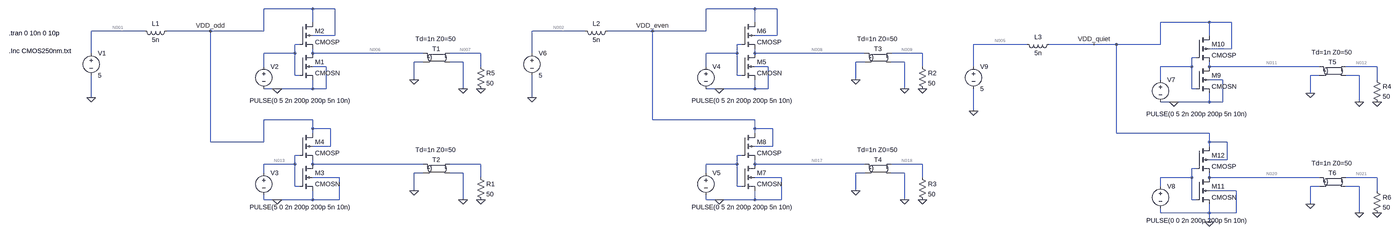
[diagram p0: schematic Draft3.asc, whole sheet]
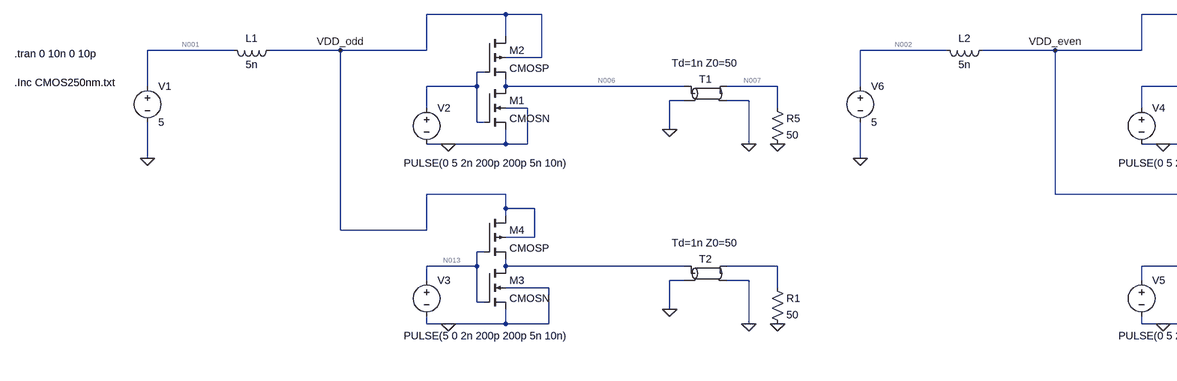
[diagram p1: schematic Draft3.asc, part, row 1 of 1, column 1 of 2]
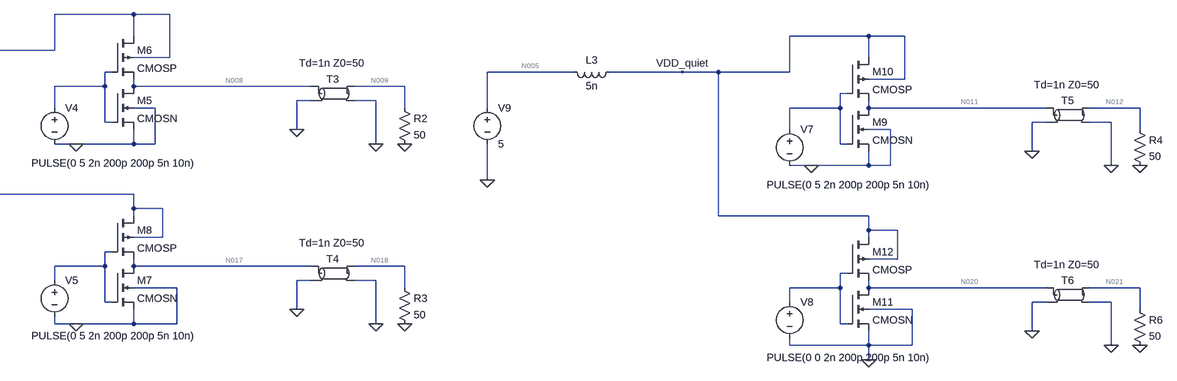
[diagram p2: schematic Draft3.asc, part, row 1 of 1, column 2 of 2]
Draft3.asc, the LTspice schematic file:
Version 4.1
SHEET 1 5000 2188
WIRE 592 416 416 416
WIRE 672 416 592 416
WIRE 2400 416 2224 416
WIRE 2480 416 2400 416
WIRE 592 464 592 416
WIRE 2400 464 2400 416
WIRE 4288 464 4112 464
WIRE 4368 464 4288 464
WIRE -176 496 -368 496
WIRE 224 496 -96 496
WIRE 416 496 416 416
WIRE 416 496 224 496
WIRE 1632 496 1440 496
WIRE 2032 496 1712 496
WIRE 2224 496 2224 416
WIRE 2224 496 2032 496
WIRE 672 512 672 416
WIRE 672 512 592 512
WIRE 2480 512 2480 416
WIRE 2480 512 2400 512
WIRE 4288 512 4288 464
WIRE 544 544 528 544
WIRE 2352 544 2336 544
WIRE 3520 544 3328 544
WIRE 3840 544 3600 544
WIRE 3920 544 3840 544
WIRE 4112 544 4112 464
WIRE 4112 544 3920 544
WIRE 4368 560 4368 464
WIRE 4368 560 4288 560
WIRE -368 576 -368 496
WIRE 528 576 528 544
WIRE 528 576 416 576
WIRE 592 576 592 560
WIRE 1040 576 592 576
WIRE 1248 576 1136 576
WIRE 1440 576 1440 496
WIRE 2336 576 2336 544
WIRE 2336 576 2224 576
WIRE 2400 576 2400 560
WIRE 2848 576 2400 576
WIRE 3056 576 2944 576
WIRE 4240 592 4224 592
WIRE 1040 608 1008 608
WIRE 1184 608 1136 608
WIRE 2848 608 2816 608
WIRE 2992 608 2944 608
WIRE 416 624 416 576
WIRE 640 624 592 624
WIRE 1248 624 1248 576
WIRE 2224 624 2224 576
WIRE 2448 624 2400 624
WIRE 3056 624 3056 576
WIRE 3328 624 3328 544
WIRE 4224 624 4224 592
WIRE 4224 624 4112 624
WIRE 4288 624 4288 608
WIRE 4736 624 4288 624
WIRE 4944 624 4832 624
WIRE 528 656 528 576
WIRE 544 656 528 656
WIRE 2336 656 2336 576
WIRE 2352 656 2336 656
WIRE 4736 656 4704 656
WIRE 4880 656 4832 656
WIRE 1008 672 1008 608
WIRE 2816 672 2816 608
WIRE 4112 672 4112 624
WIRE 4336 672 4288 672
WIRE 4944 672 4944 624
WIRE 464 704 416 704
WIRE 592 704 592 672
WIRE 592 704 464 704
WIRE 640 704 640 624
WIRE 640 704 592 704
WIRE 1184 704 1184 608
WIRE 2272 704 2224 704
WIRE 2400 704 2400 672
WIRE 2400 704 2272 704
WIRE 2448 704 2448 624
WIRE 2448 704 2400 704
WIRE 2992 704 2992 608
WIRE 4224 704 4224 624
WIRE 4240 704 4224 704
WIRE 4704 720 4704 656
WIRE -368 736 -368 656
WIRE 1440 736 1440 656
WIRE 4160 752 4112 752
WIRE 4288 752 4288 720
WIRE 4288 752 4160 752
WIRE 4336 752 4336 672
WIRE 4336 752 4288 752
WIRE 4880 752 4880 656
WIRE 3328 784 3328 704
WIRE 592 816 416 816
WIRE 2032 816 2032 496
WIRE 2400 816 2032 816
WIRE 592 848 592 816
WIRE 656 848 592 848
WIRE 2400 848 2400 816
WIRE 2464 848 2400 848
WIRE 592 864 592 848
WIRE 2400 864 2400 848
WIRE 3920 864 3920 544
WIRE 4288 864 3920 864
WIRE 224 896 224 496
WIRE 416 896 416 816
WIRE 416 896 224 896
WIRE 4288 896 4288 864
WIRE 4352 896 4288 896
WIRE 656 912 656 848
WIRE 656 912 592 912
WIRE 2464 912 2464 848
WIRE 2464 912 2400 912
WIRE 4288 912 4288 896
WIRE 544 944 528 944
WIRE 2352 944 2336 944
WIRE 4352 960 4352 896
WIRE 4352 960 4288 960
WIRE 528 976 528 944
WIRE 528 976 416 976
WIRE 592 976 592 960
WIRE 1040 976 592 976
WIRE 1248 976 1136 976
WIRE 2336 976 2336 944
WIRE 2336 976 2224 976
WIRE 2400 976 2400 960
WIRE 2848 976 2400 976
WIRE 3056 976 2944 976
WIRE 4240 992 4224 992
WIRE 416 1008 416 976
WIRE 1040 1008 1008 1008
WIRE 1184 1008 1136 1008
WIRE 2224 1008 2224 976
WIRE 2848 1008 2816 1008
WIRE 2992 1008 2944 1008
WIRE 688 1024 592 1024
WIRE 1248 1024 1248 976
WIRE 2496 1024 2400 1024
WIRE 3056 1024 3056 976
WIRE 4224 1024 4224 992
WIRE 4224 1024 4112 1024
WIRE 4288 1024 4288 1008
WIRE 4736 1024 4288 1024
WIRE 4944 1024 4832 1024
WIRE 528 1056 528 976
WIRE 544 1056 528 1056
WIRE 2336 1056 2336 976
WIRE 2352 1056 2336 1056
WIRE 4112 1056 4112 1024
WIRE 4736 1056 4704 1056
WIRE 4880 1056 4832 1056
WIRE 1008 1072 1008 1008
WIRE 2816 1072 2816 1008
WIRE 4384 1072 4288 1072
WIRE 4944 1072 4944 1024
WIRE 416 1104 416 1088
WIRE 464 1104 416 1104
WIRE 592 1104 592 1072
WIRE 592 1104 464 1104
WIRE 688 1104 688 1024
WIRE 688 1104 592 1104
WIRE 1184 1104 1184 1008
WIRE 2224 1104 2224 1088
WIRE 2272 1104 2224 1104
WIRE 2400 1104 2400 1072
WIRE 2400 1104 2272 1104
WIRE 2496 1104 2496 1024
WIRE 2496 1104 2400 1104
WIRE 2992 1104 2992 1008
WIRE 4224 1104 4224 1024
WIRE 4240 1104 4224 1104
WIRE 4704 1120 4704 1056
WIRE 4112 1152 4112 1136
WIRE 4288 1152 4288 1120
WIRE 4288 1152 4112 1152
WIRE 4384 1152 4384 1072
WIRE 4384 1152 4288 1152
WIRE 4880 1152 4880 1056
WIRE 4288 1184 4288 1152
FLAG -368 736 0
FLAG 1008 672 0
FLAG 1184 704 0
FLAG 1248 704 0
FLAG 464 704 0
FLAG 1008 1072 0
FLAG 1184 1104 0
FLAG 1248 1104 0
FLAG 464 1104 0
FLAG 1440 736 0
FLAG 2816 672 0
FLAG 2992 704 0
FLAG 3056 704 0
FLAG 2272 704 0
FLAG 2816 1072 0
FLAG 2992 1104 0
FLAG 3056 1104 0
FLAG 2272 1104 0
FLAG 3328 784 0
FLAG 4704 720 0
FLAG 4880 752 0
FLAG 4944 752 0
FLAG 4160 752 0
FLAG 4704 1120 0
FLAG 4880 1152 0
FLAG 4944 1152 0
FLAG 4288 1184 0
FLAG 3840 544 VDD_quiet
FLAG 2032 496 VDD_even
FLAG 224 496 VDD_odd
SYMBOL voltage -368 560 R0
WINDOW 123 0 0 Left 0
WINDOW 39 0 0 Left 0
SYMATTR InstName V1
SYMATTR Value 5
SYMBOL ind -80 480 R90
WINDOW 0 5 56 VBottom 2
WINDOW 3 32 56 VTop 2
SYMATTR InstName L1
SYMATTR Value 5n
SYMATTR SpiceLine Rser=1m
SYMBOL voltage 416 608 R0
WINDOW 3 -51 139 Left 2
WINDOW 123 0 0 Left 0
WINDOW 39 0 0 Left 0
SYMATTR InstName V2
SYMATTR Value PULSE(0 5 2n 200p 200p 5n 10n)
SYMBOL tline 1088 592 R0
WINDOW 3 -2 -83 Top 2
SYMATTR InstName T1
SYMATTR Value Td=1n Z0=50
SYMBOL res 1232 608 R0
SYMATTR InstName R5
SYMATTR Value 50
SYMBOL nmos4 544 576 R0
SYMATTR InstName M1
SYMATTR Value CMOSN
SYMATTR Value2 l=0.25u w=45u
SYMBOL pmos4 544 464 R0
SYMATTR InstName M2
SYMATTR Value CMOSP
SYMATTR Value2 l=0.25u w=90u
SYMBOL tline 1088 992 R0
WINDOW 3 -2 -83 Top 2
SYMATTR InstName T2
SYMATTR Value Td=1n Z0=50
SYMBOL res 1232 1008 R0
SYMATTR InstName R1
SYMATTR Value 50
SYMBOL nmos4 544 976 R0
SYMATTR InstName M3
SYMATTR Value CMOSN
SYMATTR Value2 l=0.25u w=45u
SYMBOL pmos4 544 864 R0
SYMATTR InstName M4
SYMATTR Value CMOSP
SYMATTR Value2 l=0.25u w=90u
SYMBOL voltage 416 992 R0
WINDOW 3 -51 139 Left 2
WINDOW 123 0 0 Left 0
WINDOW 39 0 0 Left 0
SYMATTR InstName V3
SYMATTR Value PULSE(5 0 2n 200p 200p 5n 10n)
SYMBOL ind 1728 480 R90
WINDOW 0 5 56 VBottom 2
WINDOW 3 32 56 VTop 2
SYMATTR InstName L2
SYMATTR Value 5n
SYMATTR SpiceLine Rser=1m
SYMBOL voltage 2224 608 R0
WINDOW 3 -51 139 Left 2
WINDOW 123 0 0 Left 0
WINDOW 39 0 0 Left 0
SYMATTR InstName V4
SYMATTR Value PULSE(0 5 2n 200p 200p 5n 10n)
SYMBOL tline 2896 592 R0
WINDOW 3 -2 -83 Top 2
SYMATTR InstName T3
SYMATTR Value Td=1n Z0=50
SYMBOL res 3040 608 R0
SYMATTR InstName R2
SYMATTR Value 50
SYMBOL nmos4 2352 576 R0
SYMATTR InstName M5
SYMATTR Value CMOSN
SYMATTR Value2 l=0.25u w=45u
SYMBOL pmos4 2352 464 R0
SYMATTR InstName M6
SYMATTR Value CMOSP
SYMATTR Value2 l=0.25u w=90u
SYMBOL tline 2896 992 R0
WINDOW 3 -2 -83 Top 2
SYMATTR InstName T4
SYMATTR Value Td=1n Z0=50
SYMBOL res 3040 1008 R0
SYMATTR InstName R3
SYMATTR Value 50
SYMBOL nmos4 2352 976 R0
SYMATTR InstName M7
SYMATTR Value CMOSN
SYMATTR Value2 l=0.25u w=45u
SYMBOL pmos4 2352 864 R0
SYMATTR InstName M8
SYMATTR Value CMOSP
SYMATTR Value2 l=0.25u w=90u
SYMBOL voltage 2224 992 R0
WINDOW 3 -51 139 Left 2
WINDOW 123 0 0 Left 0
WINDOW 39 0 0 Left 0
SYMATTR InstName V5
SYMATTR Value PULSE(0 5 2n 200p 200p 5n 10n)
SYMBOL voltage 1440 560 R0
WINDOW 123 0 0 Left 0
WINDOW 39 0 0 Left 0
SYMATTR InstName V6
SYMATTR Value 5
SYMBOL ind 3616 528 R90
WINDOW 0 5 56 VBottom 2
WINDOW 3 32 56 VTop 2
SYMATTR InstName L3
SYMATTR Value 5n
SYMATTR SpiceLine Rser=1m
SYMBOL voltage 4112 656 R0
WINDOW 3 -51 139 Left 2
WINDOW 123 0 0 Left 0
WINDOW 39 0 0 Left 0
SYMATTR InstName V7
SYMATTR Value PULSE(0 5 2n 200p 200p 5n 10n)
SYMBOL tline 4784 640 R0
WINDOW 3 -2 -83 Top 2
SYMATTR InstName T5
SYMATTR Value Td=1n Z0=50
SYMBOL res 4928 656 R0
SYMATTR InstName R4
SYMATTR Value 50
SYMBOL nmos4 4240 624 R0
SYMATTR InstName M9
SYMATTR Value CMOSN
SYMATTR Value2 l=0.25u w=45u
SYMBOL pmos4 4240 512 R0
SYMATTR InstName M10
SYMATTR Value CMOSP
SYMATTR Value2 l=0.25u w=90u
SYMBOL tline 4784 1040 R0
WINDOW 3 -2 -83 Top 2
SYMATTR InstName T6
SYMATTR Value Td=1n Z0=50
SYMBOL res 4928 1056 R0
SYMATTR InstName R6
SYMATTR Value 50
SYMBOL nmos4 4240 1024 R0
SYMATTR InstName M11
SYMATTR Value CMOSN
SYMATTR Value2 l=0.25u w=45u
SYMBOL pmos4 4240 912 R0
SYMATTR InstName M12
SYMATTR Value CMOSP
SYMATTR Value2 l=0.25u w=90u
SYMBOL voltage 3328 608 R0
WINDOW 123 0 0 Left 0
WINDOW 39 0 0 Left 0
SYMATTR InstName V9
SYMATTR Value 5
SYMBOL voltage 4112 1040 R0
WINDOW 3 -51 139 Left 2
WINDOW 123 0 0 Left 0
WINDOW 39 0 0 Left 0
SYMATTR InstName V8
SYMATTR Value PULSE(0 0 2n 200p 200p 5n 10n)
TEXT -664 568 Left 2 !.Inc CMOS250nm.txt
TEXT -664 504 Left 2 !.tran 0 10n 0 10p

The netlist it stands for:
* Draft3.asc
V1 N001 0 5
L1 VDD_odd N001 5n Rser=1m
V2 N003 0 PULSE(0 5 2n 200p 200p 5n 10n)
T1 N006 0 N007 0 Td=1n Z0=50
R5 N007 0 50
M1 N006 N003 0 0 CMOSN l=0.25u w=45u
M2 VDD_odd N003 N006 VDD_odd CMOSP l=0.25u w=90u
T2 N015 0 N016 0 Td=1n Z0=50
R1 N016 0 50
M3 N015 N013 0 0 CMOSN l=0.25u w=45u
M4 VDD_odd N013 N015 VDD_odd CMOSP l=0.25u w=90u
V3 N013 0 PULSE(5 0 2n 200p 200p 5n 10n)
L2 VDD_even N002 5n Rser=1m
V4 N004 0 PULSE(0 5 2n 200p 200p 5n 10n)
T3 N008 0 N009 0 Td=1n Z0=50
R2 N009 0 50
M5 N008 N004 0 0 CMOSN l=0.25u w=45u
M6 VDD_even N004 N008 VDD_even CMOSP l=0.25u w=90u
T4 N017 0 N018 0 Td=1n Z0=50
R3 N018 0 50
M7 N017 N014 0 0 CMOSN l=0.25u w=45u
M8 VDD_even N014 N017 VDD_even CMOSP l=0.25u w=90u
V5 N014 0 PULSE(0 5 2n 200p 200p 5n 10n)
V6 N002 0 5
L3 VDD_quiet N005 5n Rser=1m
V7 N010 0 PULSE(0 5 2n 200p 200p 5n 10n)
T5 N011 0 N012 0 Td=1n Z0=50
R4 N012 0 50
M9 N011 N010 0 0 CMOSN l=0.25u w=45u
M10 VDD_quiet N010 N011 VDD_quiet CMOSP l=0.25u w=90u
T6 N020 0 N021 0 Td=1n Z0=50
R6 N021 0 50
M11 N020 N019 0 0 CMOSN l=0.25u w=45u
M12 VDD_quiet N019 N020 VDD_quiet CMOSP l=0.25u w=90u
V9 N005 0 5
V8 N019 0 PULSE(0 0 2n 200p 200p 5n 10n)
.model NMOS NMOS
.model PMOS PMOS
.lib standard.mos
.Inc CMOS250nm.txt
.tran 0 10n 0 10p
.backanno
.end

* Results of the author's LTspice run, read from the files saved beside the schematic
* Operating Point, zero values left out:
*   V(n001) = 5 V
*   V(n002) = 5 V
*   V(n005) = 5 V
*   V(n006) = 2.639 V
*   V(n007) = 2.639 V
*   V(n008) = 2.638 V
*   V(n009) = 2.638 V
*   V(n011) = 2.638 V
*   V(n012) = 2.638 V
*   V(n013) = 5 V
*   V(n017) = 2.638 V
*   V(n018) = 2.638 V
*   V(n020) = 2.638 V
*   V(n021) = 2.638 V
*   V(vdd_even) = 5 V
*   V(vdd_odd) = 5 V
*   V(vdd_quiet) = 5 V
*   I(L1) = -52.77 mA
*   I(L2) = -105.5 mA
*   I(L3) = -105.5 mA
*   I(R1) = 49.66 pA
*   I(R2) = 52.77 mA
*   I(R3) = 52.77 mA
*   I(R4) = 52.77 mA
*   I(R5) = 52.77 mA
*   I(R6) = 52.77 mA
*   I(V1) = -52.77 mA
*   I(V6) = -105.5 mA
*   I(V9) = -105.5 mA
*   Ia(T1) = 52.77 mA
*   Ia(T2) = 49.66 pA
*   Ia(T3) = 52.77 mA
*   Ia(T4) = 52.77 mA
*   Ia(T5) = 52.77 mA
*   Ia(T6) = 52.77 mA
*   Ib(M1) = -2.649 pA
*   Ib(M10) = 2.371 pA
*   Ib(M11) = -2.648 pA
*   Ib(M12) = 2.371 pA
*   Ib(M2) = 2.371 pA
*   Ib(M4) = 5.01 pA
*   Ib(M5) = -2.648 pA
*   Ib(M6) = 2.371 pA
*   Ib(M7) = -2.648 pA
*   Ib(M8) = 2.371 pA
*   Ib(M9) = -2.648 pA
*   Ib(T1) = -52.77 mA
*   Ib(T2) = -49.66 pA
*   Ib(T3) = -52.77 mA
*   Ib(T4) = -52.77 mA
*   Ib(T5) = -52.77 mA
*   Ib(T6) = -52.77 mA
*   Ic(T1) = -52.77 mA
*   Ic(T2) = -49.66 pA
*   Ic(T3) = -52.77 mA
*   Ic(T4) = -52.77 mA
*   Ic(T5) = -52.77 mA
*   Ic(T6) = -52.77 mA
*   Id(M1) = 4.583 nA
*   Id(M10) = 52.77 mA
*   Id(M11) = 4.583 nA
*   Id(M12) = 52.77 mA
*   Id(M2) = 52.77 mA
*   Id(M3) = 288.2 pA
*   Id(M4) = 332.8 pA
*   Id(M5) = 4.583 nA
*   Id(M6) = 52.77 mA
*   Id(M7) = 4.583 nA
*   Id(M8) = 52.77 mA
*   Id(M9) = 4.583 nA
*   Id(T1) = 52.77 mA
*   Id(T2) = 49.66 pA
*   Id(T3) = 52.77 mA
*   Id(T4) = 52.77 mA
*   Id(T5) = 52.77 mA
*   Id(T6) = 52.77 mA
*   Is(M1) = -4.58 nA
*   Is(M10) = -52.77 mA
*   Is(M11) = -4.58 nA
*   Is(M12) = -52.77 mA
*   Is(M2) = -52.77 mA
*   Is(M3) = -288.2 pA
*   Is(M4) = -337.8 pA
*   Is(M5) = -4.58 nA
*   Is(M6) = -52.77 mA
*   Is(M7) = -4.58 nA
*   Is(M8) = -52.77 mA
*   Is(M9) = -4.58 nA
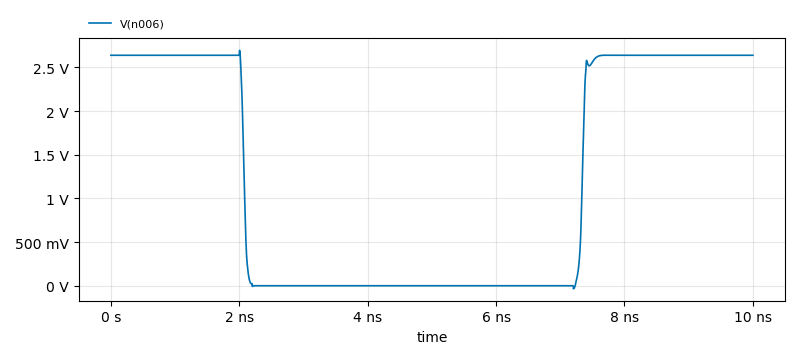
[diagram p3: Transient Analysis of Draft3.asc, plotted from the saved traces]
* Transient Analysis, 1 run:
*   V(n006): min -35.03 mV, max 2.695 V, average 1.248 V, rms 1.806 V, last 2.639 V